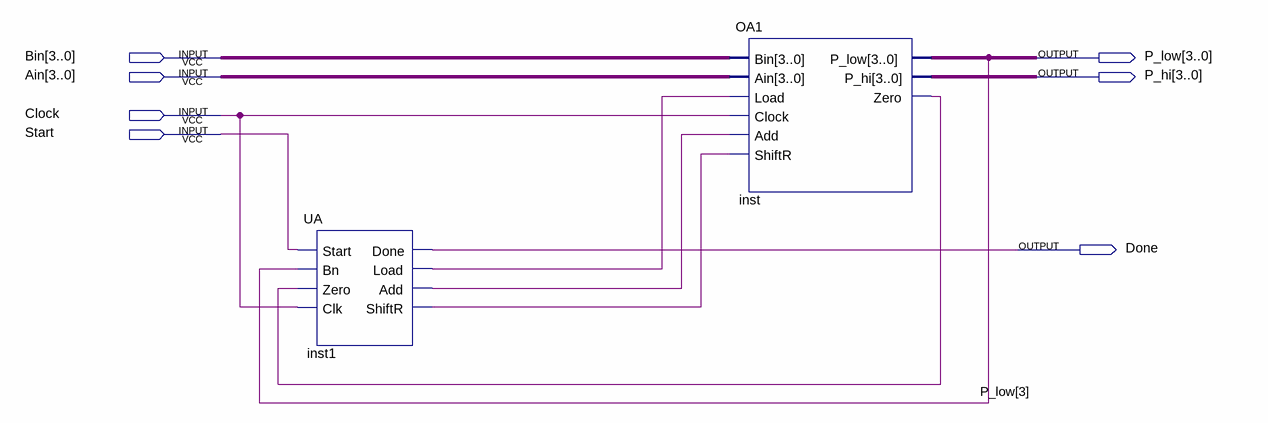
[diagram p0: schematic sheet]
// Quartus schematic FSM.bdf as structural Verilog: 2 symbols, 7 pins
module FSM (
  input  [3:0] Bin,
  input  [3:0] Ain,
  input  Clock,
  input  Start,
  output [3:0] P_low,
  output [3:0] P_hi,
  output Done
);

  wire inst1_add, inst1_load, inst1_shiftr, inst_zero;

  UA inst1 (
    .Start(Start), .Bn(P_low[3]), .Zero(inst_zero), .Clk(Clock), .Done(Done), .Load(inst1_load),
    .Add(inst1_add), .ShiftR(inst1_shiftr));
  OA1 inst (
    .Bin(Bin), .Ain(Ain), .Load(inst1_load), .Clock(Clock), .Add(inst1_add), .ShiftR(inst1_shiftr),
    .P_low(P_low), .P_hi(P_hi), .Zero(inst_zero));
endmodule
